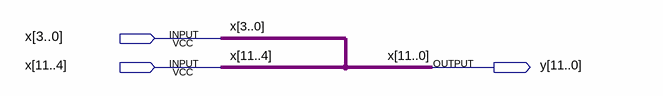
[diagram p0: schematic sheet]
// Quartus schematic connector.bdf as structural Verilog: 0 symbols, 3 pins
module connector (
  input  [11:0] x,
  output [11:0] y
);


  assign y = x;
endmodule
